# EAGLE design JLink-OB (EAGLE 7.3.0)
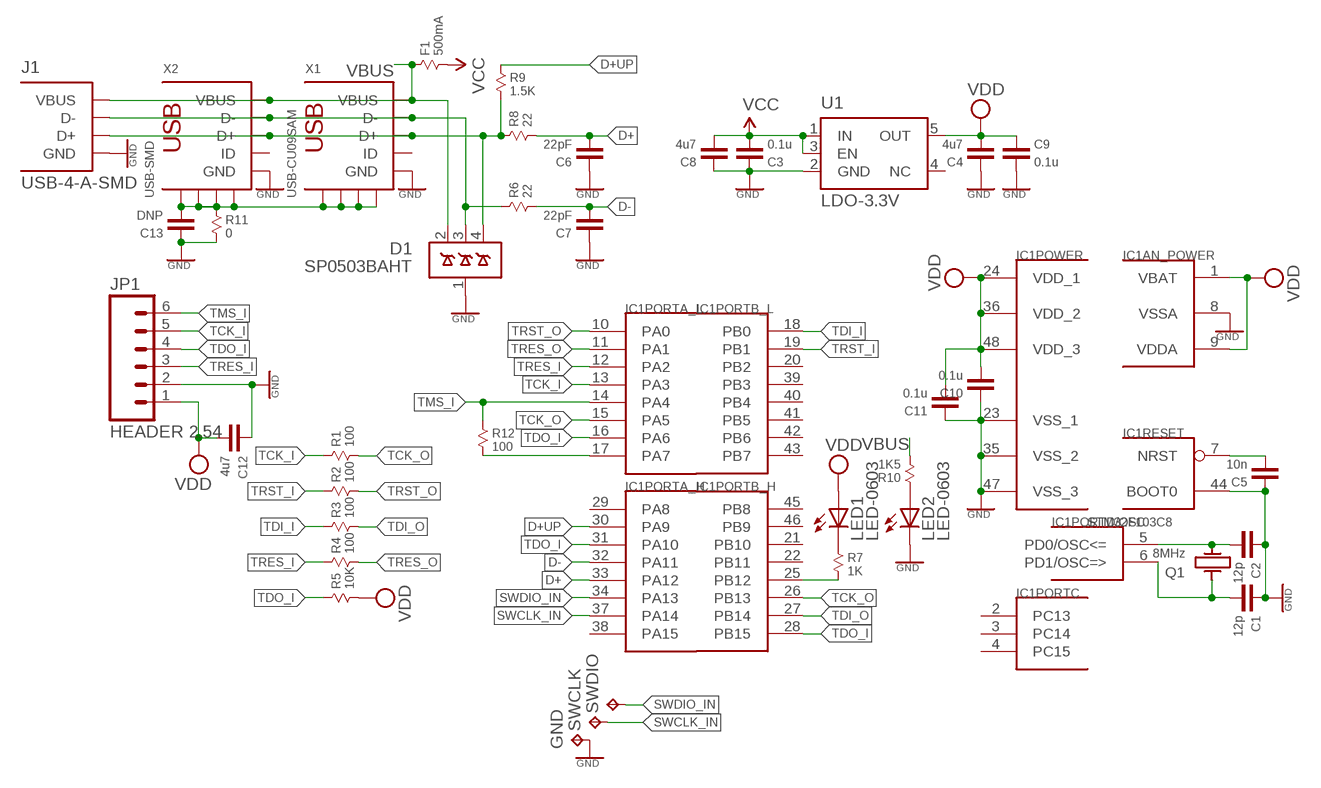
[diagram p0: schematic, sheet 1]

## Parts
C1  12p  CAP-0603  [0603]
C2  12p  CAP-0603  [0603]
C3  0.1u  CAP-0603  [0603]
C4  4u7  CAP-0603  [0603]
C5  10n  CAP-0603  [0603]
C6  22pF  CAP-0603  [0603]
C7  22pF  CAP-0603  [0603]
C8  4u7  CAP-0603  [0603]
C9  0.1u  CAP-0603  [0603]
C10  0.1u  CAP-0603  [0603]
C11  0.1u  CAP-0603  [0603]
C12  4u7  CAP-0603  [0603]
C13  DNP  CAP-0603  [0603]
D1  SP0503BAHT  [SOT143]
F1  500mA  RESISTOR-0805  [0805]
GND  TPTP12R  [TP12R]
IC1  STM32F103C8  STM32F10XCXT6  [TQFP48]
J1  USB-4-A-SMD  [USB-A-SMD]
JP1  HEADER 2.54  M06SIP  [1X06]
LED1  LED-0603  LEDCHIPLED_0603  [CHIPLED_0603]
LED2  LED-0603  LEDCHIPLED_0603  [CHIPLED_0603]
Q1  8MHz  CRYSTAL-KX-9A  [KX-9A]
R1  100  RESISTOR-0603  [0603]
R2  100  RESISTOR-0603  [0603]
R3  100  RESISTOR-0603  [0603]
R4  100  RESISTOR-0603  [0603]
R5  10K  RESISTOR-0603  [0603]
R6  22  RESISTOR-0603  [0603]
R7  1K  RESISTOR-0603  [0603]
R8  22  RESISTOR-0603  [0603]
R9  1.5K  RESISTOR-0603  [0603]
R10  1K5  RESISTOR-0603  [0603]
R11  0  RESISTOR-0603  [0603]
R12  100  RESISTOR-0603  [0603]
SWCLK  TPTP12R  [TP12R]
SWDIO  TPTP12R  [TP12R]
U1  LDO-3.3V  TPS73033-DC  [SOT23-5]
X1  USB-CU09SAM  [CU09SAM]
X2  USB-SMD  [USB-MINIB]

## Nets
D+: C6.1 IC1.33(PORTA_H:PA12) R8.2
D+UP: IC1.30(PORTA_H:PA9) R9.1
D-: C7.1 IC1.32(PORTA_H:PA11) R6.2
GND: C1.2 C2.2 C3.2 C4.2 C5.2 C6.2 C7.2 C8.2 C9.1 C10.2 C11.2 C12.2 C13.2 D1.1(GND) GND.TP IC1.8(AN_POWER:VSSA) IC1.23(POWER:VSS_1) IC1.35(POWER:VSS_2) IC1.44(RESET:BOOT0) IC1.47(POWER:VSS_3) J1.GND JP1.2 LED2.C R11.2 U1.2(GND) X1.5(GND) X2.GND
N$1: C5.1 IC1.7(RESET:NRST)
N$2: D1.4(D3) J1.D+ R8.1 R9.2 X1.3(D+) X2.D+
N$3: IC1.25(PORTB_H:PB12) R7.2
N$4: D1.3(D2) J1.D- R6.1 X1.2(D-) X2.D-
N$5: C2.1 IC1.5(PORTD/OSC:PD0/OSC<=) Q1.3
N$6: C1.1 IC1.6(PORTD/OSC:PD1/OSC=>) Q1.1
N$7: LED2.A R10.1
N$8: LED1.C R7.1
N$10: C13.1 R11.1 X1.GND@1(GND) X1.GND@2(GND) X1.GND@3(GND) X1.GND@4(GND) X2.GND@1(GND) X2.GND@2(GND) X2.GND@3(GND) X2.GND@4(GND)
SWCLK_IN: IC1.37(PORTA_H:PA14) SWCLK.TP
SWDIO_IN: IC1.34(PORTA_H:PA13) SWDIO.TP
TCK_I: IC1.13(PORTA_L:PA3) JP1.5 R1.1
TCK_O: IC1.15(PORTA_L:PA5) IC1.26(PORTB_H:PB13) R1.2
TDI_I: IC1.18(PORTB_L:PB0) R3.1
TDI_O: IC1.27(PORTB_H:PB14) R3.2
TDO_I: IC1.16(PORTA_L:PA6) IC1.28(PORTB_H:PB15) IC1.31(PORTA_H:PA10) JP1.4 R5.1
TMS_I: IC1.14(PORTA_L:PA4) JP1.6 R12.1
TMS_O: IC1.17(PORTA_L:PA7) R12.2
TRES_I: IC1.12(PORTA_L:PA2) JP1.3 R4.1
TRES_O: IC1.11(PORTA_L:PA1) R4.2
TRST_I: IC1.19(PORTB_L:PB1) R2.1
TRST_O: IC1.10(PORTA_L:PA0) R2.2
VBUS: D1.2(D1) F1.1 J1.VUSB(VBUS) R10.2 X1.1(VBUS) X2.VBUS
VCC: C3.1 C8.1 F1.2 U1.1(IN) U1.3(EN)
VDD: C4.1 C9.2 C10.1 C11.1 C12.1 IC1.1(AN_POWER:VBAT) IC1.9(AN_POWER:VDDA) IC1.24(POWER:VDD_1) IC1.36(POWER:VDD_2) IC1.48(POWER:VDD_3) JP1.1 LED1.A R5.2 U1.5(OUT)
Unconnected: IC1.2(PORTC:PC13) IC1.3(PORTC:PC14) IC1.4(PORTC:PC15) IC1.20(PORTB_L:PB2) IC1.21(PORTB_H:PB10) IC1.22(PORTB_H:PB11) IC1.29(PORTA_H:PA8) IC1.38(PORTA_H:PA15) IC1.39(PORTB_L:PB3) IC1.40(PORTB_L:PB4) IC1.41(PORTB_L:PB5) IC1.42(PORTB_L:PB6) IC1.43(PORTB_L:PB7) IC1.45(PORTB_H:PB8) IC1.46(PORTB_H:PB9) U1.4(NC) X1.4(ID) X2.ID

## Library data of the parts
C1-C13 = X893:CAP: Capacitor
D1 = X893:SP0503BAHT: Surface Mount TVS Avalanche Diode Array (5V) http://www.littelfuse.com/data/en/Data_Sheets/SP05xxBA.pdf
F1 R1-R12 = X893:RESISTOR
GND SWCLK SWDIO = testpad:TP: Test pad
IC1 = stm32:STM32F10XCXT6: ST STM32F101/103 48pin LQFP
J1 = X893:USB-4: http://www.hirose.co.jp/cataloge_hp/e24200011.pdf
JP1 = SparkFun:M06: Header 6 Standard 6-pin 0.1" header. Use with straight break away headers (SKU : PRT-00116), right angle break away headers (PRT-00553), swiss pins (PRT-00743), machine pins (PRT-00117), and female headers (PRT-00115). Molex polarized connector foot print use with SKU : PRT-08094 with associated crimp pins and housings. NOTES ON THE VARIANTS LOCK and LOCK_LONGPADS... This footprint was designed to help hold the alignment of a through-hole component (i.e. 6-pin header) while soldering it into place. You may notice that each hole has been shifted either up or down by 0.005 of an inch from it's more standard position (which is a perfectly straight line). This slight alteration caused the pins (the squares in the middle) to touch the edges of the holes. Because they are alternating, it causes a "brace" to hold the component in place. 0.005 has proven to be the perfect amount of "off-center" position when using our standard breakaway headers. Although looks a little odd when you look at the bare footprint, once you have a header in there, the alteration is very hard to notice. Also, if you push a header all the way into place, it is covered up entirely on the bottom side. This idea of altering the position of holes to aid alignment will be further integrated into the Sparkfun Library for other footprints. It can help hold any component with 3 or more connection pins.
LED1 LED2 = led:LED: LED OSRAM: - CHIPLED LG R971, LG N971, LY N971, LG Q971, LY Q971, LO R971, LY R971 LH N974, LH R974 LS Q976, LO Q976, LY Q976 LO Q996 - Hyper CHIPLED LW Q18S LB Q993, LB Q99A, LB R99A - SideLED LS A670, LO A670, LY A670, LG A670, LP A670 LB A673, LV A673, LT A673, LW A673 LH A674 LY A675 LS A676, LA A676, LO A676, LY A676, LW A676 LS A679, LY A679, LG A679 - Hyper Micro SIDELED® LS Y876, LA Y876, LO Y876, LY Y876 LT Y87S - SmartLED LW L88C, LW L88S LB L89C, LB L89S, LG L890 LS L89K, LO L89K, LY L89K LS L896, LA L896, LO L896, LY L896 - TOPLED LS T670, LO T670, LY T670, LG T670, LP T670 LSG T670, LSP T670, LSY T670, LOP T670, LYG T670 LG T671, LOG T671, LSG T671 LB T673, LV T673, LT T673, LW T673 LH T674 LS T676, LA T676, LO T676, LY T676, LB T676, LH T676, LSB T676, LW T676 LB T67C, LV T67C, LT T67C, LS T67K, LO T67K, LY T67K, LW E67C LS E67B, LA E67B, LO E67B, LY E67B, LB E67C, LV E67C, LT E67C LW T67C LS T679, LY T679, LG T679 LS T770, LO T770, LY T770, LG T770, LP T770 LB T773, LV T773, LT T773, LW T773 LH T774 LS E675, LA E675, LY E675, LS T675 LS T776, LA T776, LO T776, LY T776, LB T776 LHGB T686 LT T68C, LB T68C - Hyper Mini TOPLED® LB M676 - Mini TOPLED Santana® LG M470 LS M47K, LO M47K, LY M47K Source: http://www.osram.convergy.de LUXEON: - LUMILED® LXK2-PW12-R00, LXK2-PW12-S00, LXK2-PW14-U00, LXK2-PW14-V00 LXK2-PM12-R00, LXK2-PM12-S00, LXK2-PM14-U00 LXK2-PE12-Q00, LXK2-PE12-R00, LXK2-PE12-S00, LXK2-PE14-T00, LXK2-PE14-U00 LXK2-PB12-K00, LXK2-PB12-L00, LXK2-PB12-M00, LXK2-PB14-N00, LXK2-PB14-P00, LXK2-PB14-Q00 LXK2-PR12-L00, LXK2-PR12-M00, LXK2-PR14-Q00, LXK2-PR14-R00 LXK2-PD12-Q00, LXK2-PD12-R00, LXK2-PD12-S00 LXK2-PH12-R00, LXK2-PH12-S00 LXK2-PL12-P00, LXK2-PL12-Q00, LXK2-PL12-R00 Source: www.luxeon.com KINGBRIGHT: KA-3528ASYC Source: www.kingbright.com
Q1 = X893:CRYSTAL: KX-9A <http://www.kosmodrom.com.ua/pdf/KX-9A.pdf> KX-KT <http://www.kosmodrom.com.ua/pdf/KX-K.pdf>
U1 = X893:TPS73033: LOW-NOISE, HIGH PSRR, RF 200-mA LOW-DROPOUT LINEAR REGULATOR http://www.terraelectronica.ru/pdf/TI/TPS73033.pdf
X1 X2 = X893:USB: USB Connectors USB-B-PTH is fully proven SKU : PRT-00139 USB-miniB is fully proven SKU : PRT-00587 USB-A-PCB is untested. USB-A-H is throughly reviewed, but untested. Spark Fun Electronics SKU : PRT-00437 USB-B-SMT is throughly reviewed, but untested. Needs silkscreen touching up. USB-A-S has not been used/tested USB-MB-H has not been used/tested

## Board
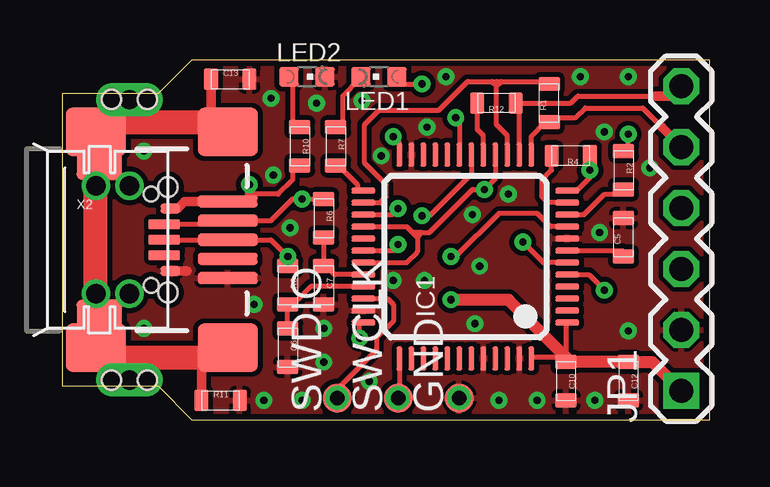
[diagram p1: board, top side]
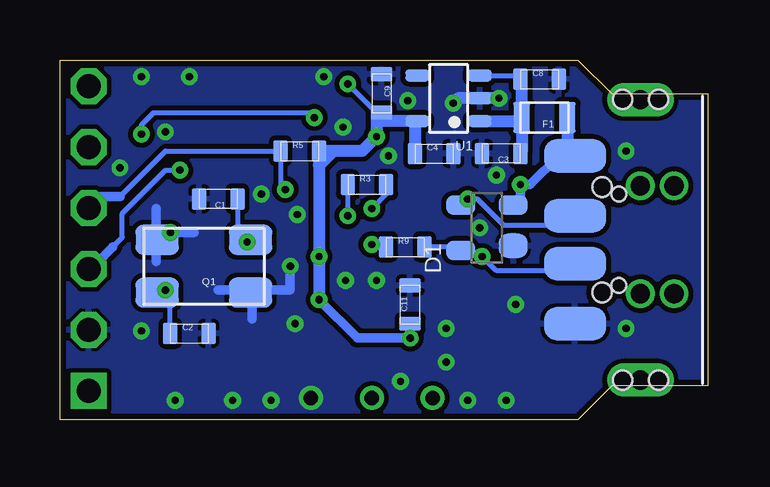
[diagram p2: board, bottom side, seen from below]

Size 27 x 15 mm. Coordinates in mm from the lower left corner, seen from the top.
Outline: 27,0 27,15 5.4,15 4,13.6 0,13.6 0,1.4 4,1.4 5.4,0 27,0
Copper layers (1+16): Top 0.018mm / dielectric 0.8mm / Bottom 0.018mm
Design rules "Rezonit-020-015": minimum track width 0.15mm, minimum drill 0.3mm, track to track 0.2mm, track to pad 0.2mm, pad to pad 0.2mm, via to via 0.2mm, smd to smd 0mil, copper to edge 0.25mm, drill to drill 0.3mm, minimum pad ring 0.2mm, minimum via ring 0.2mm, stop-mask expansion 4mil, vias tented up to drill 0.4mm, thermal gap 0.15mm

### Footprints (pad centres in the part's own frame; a part is rotated, then mirrored left to right if it is on the bottom)
0603 = smd 0.6 x 0.9: 1 -0.8,0; 2 0.8,0
SOT143 = smd 1 x 1.2: 1 -0.75,-1.1 | smd 0.8 x 1.2: 2 0.95,-1.1; 3 0.95,1.1; 4 -0.95,1.1
0805 = smd 0.7 x 1.3: 1 -0.95,0; 2 0.95,0
TP12R = smd 1.2 x 1.2: TP 0,0
TQFP48 = smd 0.25 x 1: 1 -2.75,-4.25; 2 -2.25,-4.25; 3 -1.75,-4.25; 4 -1.25,-4.25; 5 -0.75,-4.25; 6 -0.25,-4.25; 7 0.25,-4.25; 8 0.75,-4.25; 9 1.25,-4.25; 10 1.75,-4.25; 11 2.25,-4.25; 12 2.75,-4.25; 25 2.75,4.25; 26 2.25,4.25; 27 1.75,4.25; 28 1.25,4.25; 29 0.75,4.25; 30 0.25,4.25; 31 -0.25,4.25; 32 -0.75,4.25; 33 -1.25,4.25; 34 -1.75,4.25; 35 -2.25,4.25; 36 -2.75,4.25 | smd 1 x 0.25: 13 4.25,-2.75; 14 4.25,-2.25; 15 4.25,-1.75; 16 4.25,-1.25; 17 4.25,-0.75; 18 4.25,-0.25; 19 4.25,0.25; 20 4.25,0.75; 21 4.25,1.25; 22 4.25,1.75; 23 4.25,2.25; 24 4.25,2.75; 37 -4.25,2.75; 38 -4.25,2.25; 39 -4.25,1.75; 40 -4.25,1.25; 41 -4.25,0.75; 42 -4.25,0.25; 43 -4.25,-0.25; 44 -4.25,-0.75; 45 -4.25,-1.25; 46 -4.25,-1.75; 47 -4.25,-2.25; 48 -4.25,-2.75
USB-A-SMD = smd 2.6 x 1.4: D+ 5.325,1; D- 5.325,-1; GND 5.325,3.5; VUSB 5.325,-3.5 | drill 0.8 pad 1.4 long: GND@1 2.6,5.85; GND@2 2.6,-5.85 | drill 0.8: P$1 2.6,2.25; P$2 2.6,-2.25; P$3 1.2,2.25; P$4 1.2,-2.25 | hole 0.8: 3.35,-5.85; 1.85,-5.85; 3.35,5.85; 1.85,5.85
1X06 = drill 1 pad 1.5 square: 1 0,0 | drill 1 pad 1.5 octagon: 2 2.54,0; 3 5.08,0; 4 7.62,0; 5 10.16,0; 6 12.7,0
CHIPLED_0603 = smd 0.8 x 0.8: A 0,-0.75; C 0,0.75
KX-9A = smd 1.8 x 1.25: 1 -1.95,-1.1; 2 1.95,-1.1; 3 1.95,1.1; 4 -1.95,1.1
SOT23-5 = smd 0.5 x 1: 1 -0.95,-1.3; 2 0,-1.3; 3 0.95,-1.3; 4 0.95,1.3; 5 -0.95,1.3
CU09SAM = smd 0.4 x 0.8: 1 1.3,-5.1; 5 -1.3,-5.1 | smd 0.4 x 1.3: 2 0.65,-4.85; 3 0,-4.85; 4 -0.65,-4.85 | smd 1.8 x 1.9: GND@1 -3.4,-2.15; GND@4 3.4,-2.15 | smd 1 x 1: GND@2 -3.2,-2.2; GND@3 3.2,-2.2 | hole 0.6: -1.9,-4.3; 1.9,-4.3
USB-MINIB = smd 2.5 x 0.5: D+ 2.5,0; D- 2.5,0.8; GND 2.5,-1.6; ID 2.5,-0.8; VBUS 2.5,1.6 | smd 2.5 x 2: GND@1 -3,-4.5; GND@2 -3,4.5; GND@3 2.5,4.5; GND@4 2.5,-4.5 | hole 0.8: 0,2.2; 0,-2.2

### Placement (x,y rotation side)
C1  20.4,9.2 180 bottom
C2  21.6,3.6 0 bottom
C3  8.6,11.1 180 bottom
C4  11.4,11.1 0 bottom
C5  23.4,7.6 90 top
C6  9.4,3 270 top
C7  10.9,5.6 270 top
C8  7,14.2 0 bottom
C9  13.6,13.6 270 bottom
C10  21,1.6 270 top
C11  12.4,4.8 90 bottom
C12  23.6,1.6 270 top
C13  7,14.2 0 top
D1  9.2,8 90 bottom
F1  6.8,12.6 180 bottom
GND  16.54,0.9 90 top
IC1  16.8,6.8 90 top
J1  0.2,7.5 180 bottom
JP1  25.8,1.2 90 top
LED1  13.2,14.3 90 top
LED2  10.2,14.3 270 top
Q1  21,6.4 180 bottom
R1  20.3,13.2 90 top
R2  23.4,10.4 270 top
R3  14.2,9.8 0 bottom
R4  21.2,11 180 top
R5  17,11.2 0 bottom
R6  10.9,8.4 270 top
R7  11.4,11.4 270 top
R8  9.4,5.6 270 top
R9  12.6,7.2 0 bottom
R10  9.9,11.4 270 top
R11  6.6,0.8 0 top
R12  18.1,13.2 180 top
SWCLK  14,0.9 90 top
SWDIO  11.46,0.9 90 top
U1  10.8,13.4 90 bottom
X1  -0.6,7.5 90 top
X2  4.4,7.5 0 top

### Tracks (layer width: path | path; a pad name or v marks a point on that pad's centre or on a via)
D+
  Top 0.2: IC1.33 10.35,5.55 9.8,5 9.4,5 R8.2 C6.1
D+UP  (via drill 0.3)
  Top 0.2: IC1.30 13.8,7.05 v14,7.3
  Bottom 0.2: R9.1 13.9,7.2 v14,7.3
D-
  Top 0.2: R6.2 C7.1 11.1,6.2 11.2,6.2 11.35,6.05 IC1.32
GND  (via drill 0.3, 0.6)
  Top 0.4: 4.4,6.2 5.2,6.2
  Bottom 0.4: v17.4,6.4 17.4,5.4 19,5.4 | 19,5.4 20.4,5.4 | 19,5.4 19,4.2 | 21.4,7.8 23,7.8 | 23,7.8 23,6.6 | 23,8.8 23,7.8
  Bottom 0.5: v8.7,13.4 10.4,13.4 v10.6,13.2
  other vias: 15.2,12.2 13.8,5.8 16.54,0.9 16,14.3 22.2,0.8 8.4,0.8 23.6,14.3 18.6,9.4 23.6,3.7 17.2,4 18.2,0.8 10,0.8 21.6,14.3 13.3,11 19.8,0.8 15.1,5.8 22.4,7.8 8.8,10.2 8,4.8 3.4,3.8 9.5,8 3.4,11.2 17.1,8.55 12.5,13.3 12.8,1.6 10.9,3.8 24.5,10.5 22.6,12 10.9,2.4
  pour Top (isolate 0.2): 26.8,0.2 26.8,14.8 5.4,14.8 4,13.4 0.2,13.4 0.2,1.6 4,1.6 5.4,0.2
  pour Bottom (isolate 0.2): 26.8,0.2 26.8,14.8 5.4,14.8 4,13.4 0.2,13.4 0.2,1.6 4,1.6 5.4,0.2
N$1
  Top 0.2: IC1.7 23.35,7.05 C5.1
N$2  (via drill 0.3)
  Top 0.2: X1.3 X2.D+ 8.7,7.5 v9.4,6.8 R8.1
  Bottom 0.2: R9.2 10.35,7.2 D1.4 10.2,7.15 10.2,7 9.6,7 v9.4,6.8 8.8,6.2 5.83,6.2 J1.D+
N$3
  Top 0.2: 12.45,9.55 IC1.25 12.3,9.55 12.3,9.8 11.8,10.3 R7.2
N$4  (via drill 0.3)
  Top 0.2: X1.2 6.9,8.15 X2.D- 8.7,8.3 9.6,9.2 v10,9.2 R6.1
  Bottom 0.2: D1.3 10,9.15 v10,9.2 9.6,9.2 8.5,8.1 5.92,8.1 J1.D-
N$5  (via drill 0.3)
  Top 0.2: IC1.5 21.95,6.05 v22.6,5.4
  Bottom 0.2: v22.6,5.4 23.05,5.4 Q1.3 22.4,4.75 C2.1
N$6  (via drill 0.3)
  Top 0.2: IC1.6 20.05,6.55 v19.2,7.4
  Bottom 0.2: C1.1 19.6,7.65 Q1.1 18.95,7.4 v19.2,7.4
N$7
  Top 0.2: LED2.A 9.5,14.3 9.4,14.2 9.6,14.2 9.6,12.2 R10.1
N$8
  Top 0.2: R7.1 11.7,12.2 11.7,13.5 12.4,14.2 12.4,14.25 LED1.C
N$10
  Top 0.4: C13.1 6.2,12.4 | R11.1 5.8,2.6
  Top 1: 1.4,4.1 X2.GND@1 1.4,2.6 5.8,2.6 6.8,2.6 6.8,3 X2.GND@4 | 1.4,4.1 1.4,10.9 | 1.4,10.9 X2.GND@2 1.4,12.4 6.2,12.4 6.8,12.4 6.8,12 X2.GND@3 | X1.GND@3 1.55,10.7 X1.GND@4 1.4,10.9 | X1.GND@2 1.55,4.3 X1.GND@1 1.4,4.1
SWCLK_IN  (via drill 0.6)
  Top 0.2: IC1.37 14.05,0.95 SWCLK.TP
  other vias: 14,0.9
SWDIO_IN  (via drill 0.6)
  Top 0.2: IC1.34 13.55,5.05 13.8,4.8 13.8,4.1 13.1,3.4 13.1,2.9 11.52,1.32 SWDIO.TP
  other vias: 11.46,0.9
TCK_I
  Top 0.2: IC1.13 19.55,11.8 20.15,12.4 R1.1 20.3,12.6 21.4,12.6 21.8,13 24.2,13 25,12.2 | 25.6,11.6 25.8,11.4 JP1.5
  Top 0.4: 25,12.2 25.6,11.6
TCK_O
  Top 0.2: IC1.15 18.55,11.85 18.1,12.3 18.1,13.9 | IC1.26 13.25,9.05 13.5,9.3 13.5,9.8 12.6,10.7 12.6,12.3 13.2,12.9 15.7,12.9 16.9,14.1 17.9,14.1 | 17.9,14.1 18.1,14.1 | 18.1,14.1 18.3,14.1 | 18.3,14.1 19.9,14.1 R1.2 | 18.1,13.9 18.1,14.1 | 18.1,13.9 18.3,14.1 | 18.1,13.9 17.9,14.1
TDI_I  (via drill 0.3)
  Top 0.2: v15,8.5 15.3,8.5 17.05,10.25 IC1.18
  Bottom 0.2: v15,8.5 R3.1
TDI_O  (via drill 0.3)
  Top 0.2: IC1.27 13.75,8.55 v14,8.8
  Bottom 0.2: R3.2 13.4,9.4 v14,8.8
TDO_I  (via drill 0.3)
  Top 0.2: IC1.31 14.35,6.55 14.8,7 14.8,7.6 | IC1.16 18.05,10.05 v17.6,9.6 17.1,9.6 15.3,7.8 15,7.8 | IC1.28 14.35,8.05 14.6,7.8 | 14.6,7.8 14.8,7.6 | 15,7.8 14.6,7.8 | 14.8,7.6 15,7.8
  Bottom 0.2: JP1.4 25.32,9.3 | 24.5,9.3 22.6,11.2 R5.1 17.8,9.8 v17.6,9.6
  Bottom 0.4: 24.5,9.3 25.32,9.3 25.6,9.3
TMS_I
  Top 0.2: IC1.14 19.05,13.2 | R12.1 19.05,13.2 | 19.05,13.2 21.2,13.2 21.5,13.5 24.7,13.5 | 25.5,13.5 25.8,13.8 JP1.6
  Top 0.4: 24.7,13.5 25.5,13.5
TMS_O
  Top 0.2: IC1.17 17.55,11.85 17.3,12.1 R12.2
TRES_I  (via drill 0.3)
  Top 0.2: R4.1 v22,10.4 22,10.1 21.45,9.55 IC1.12
  Bottom 0.2: JP1.3 25.48,6.6 25.4,6.6 24.8,7.2 24.4,7.6 24.4,8.6 22.6,10.4 v22,10.4
  Bottom 0.4: 24.8,7.2 25.5,6.5
TRES_O
  Top 0.2: IC1.11 20.25,9.05 20,9.3 20,10 20.4,10.4 R4.2
TRST_I  (via drill 0.3)
  Top 0.2: R2.1 23.6,11.2 v23.6,11.9 | v16.4,12.6 16.55,12.45 IC1.19
  Bottom 0.2: v16.4,12.6 16.6,12.8 23.1,12.8 23.6,12.3 v23.6,11.9
TRST_O
  Top 0.2: R2.2 23.4,9.4 22.6,9.4 21.75,8.55 IC1.10
VBUS  (via drill 0.3)
  Top 0.2: R10.2 9.6,10.6 9.6,10 9,9.4 7.8,9.4
  Top 0.4: X1.1 4.8,8.8 5.1,9.1 X2.VBUS 7.8,9.1 7.8,9.4 v7.8,9.8
  Bottom 0.4: J1.VUSB 6.2,11 7.4,9.8 v7.8,9.8 7.8,9.05 D1.2
  Bottom 0.5: F1.1 5.85,11.32 J1.VUSB
VCC
  Bottom 0.2: U1.3 7.95,14.35 C8.1
  Bottom 0.5: F1.2 7.75,14.15 C8.1 | F1.2 7.75,11.15 C3.1 | U1.1 7.9,12.45 F1.2
VDD  (via drill 0.3)
  Top 0.2: IC1.24 14.05,11.55 v13.8,11.8 | IC1.9 20.35,8.05 19.8,8.6 18.2,8.6 16.4,6.8 v16.2,6.8 | IC1.1 21,4.05 C10.1 | 21,2.6 19.55,2.6 IC1.48 | v12.4,3.4 12.4,4.05 IC1.36 | LED1.A 13.95,14.05 14,14 v15,14
  Top 0.4: 21,2.6 C10.1
  Top 0.5: v16.2,5 18.6,5 21,2.6 | C10.1 C12.1 24.6,2.4 JP1.1
  Bottom 0.2: C9.2 14,13 v15,14
  Bottom 0.4: v16.2,5 14.6,3.4 v12.4,3.4 C11.1 | C9.2 13.6,12.6 13.8,12.6
  Bottom 0.5: 15.6,11.2 14.4,11.2 v13.8,11.8 13.8,12.45 | 15.6,11.2 R5.2 16.2,10.6 | 16.2,10.6 v16.2,6.8 v16.2,5 | 13.8,12.6 13.8,12.45 | U1.5 12.2,12.45 | 12.2,12.45 C4.1 | 12.2,12.45 13.8,12.45 | 16.2,10.6 15.6,11.2

### Text on the board
Reference: PWR | ACT | SWDIO | SWCLK | SWO | RESET | GND | +3.3